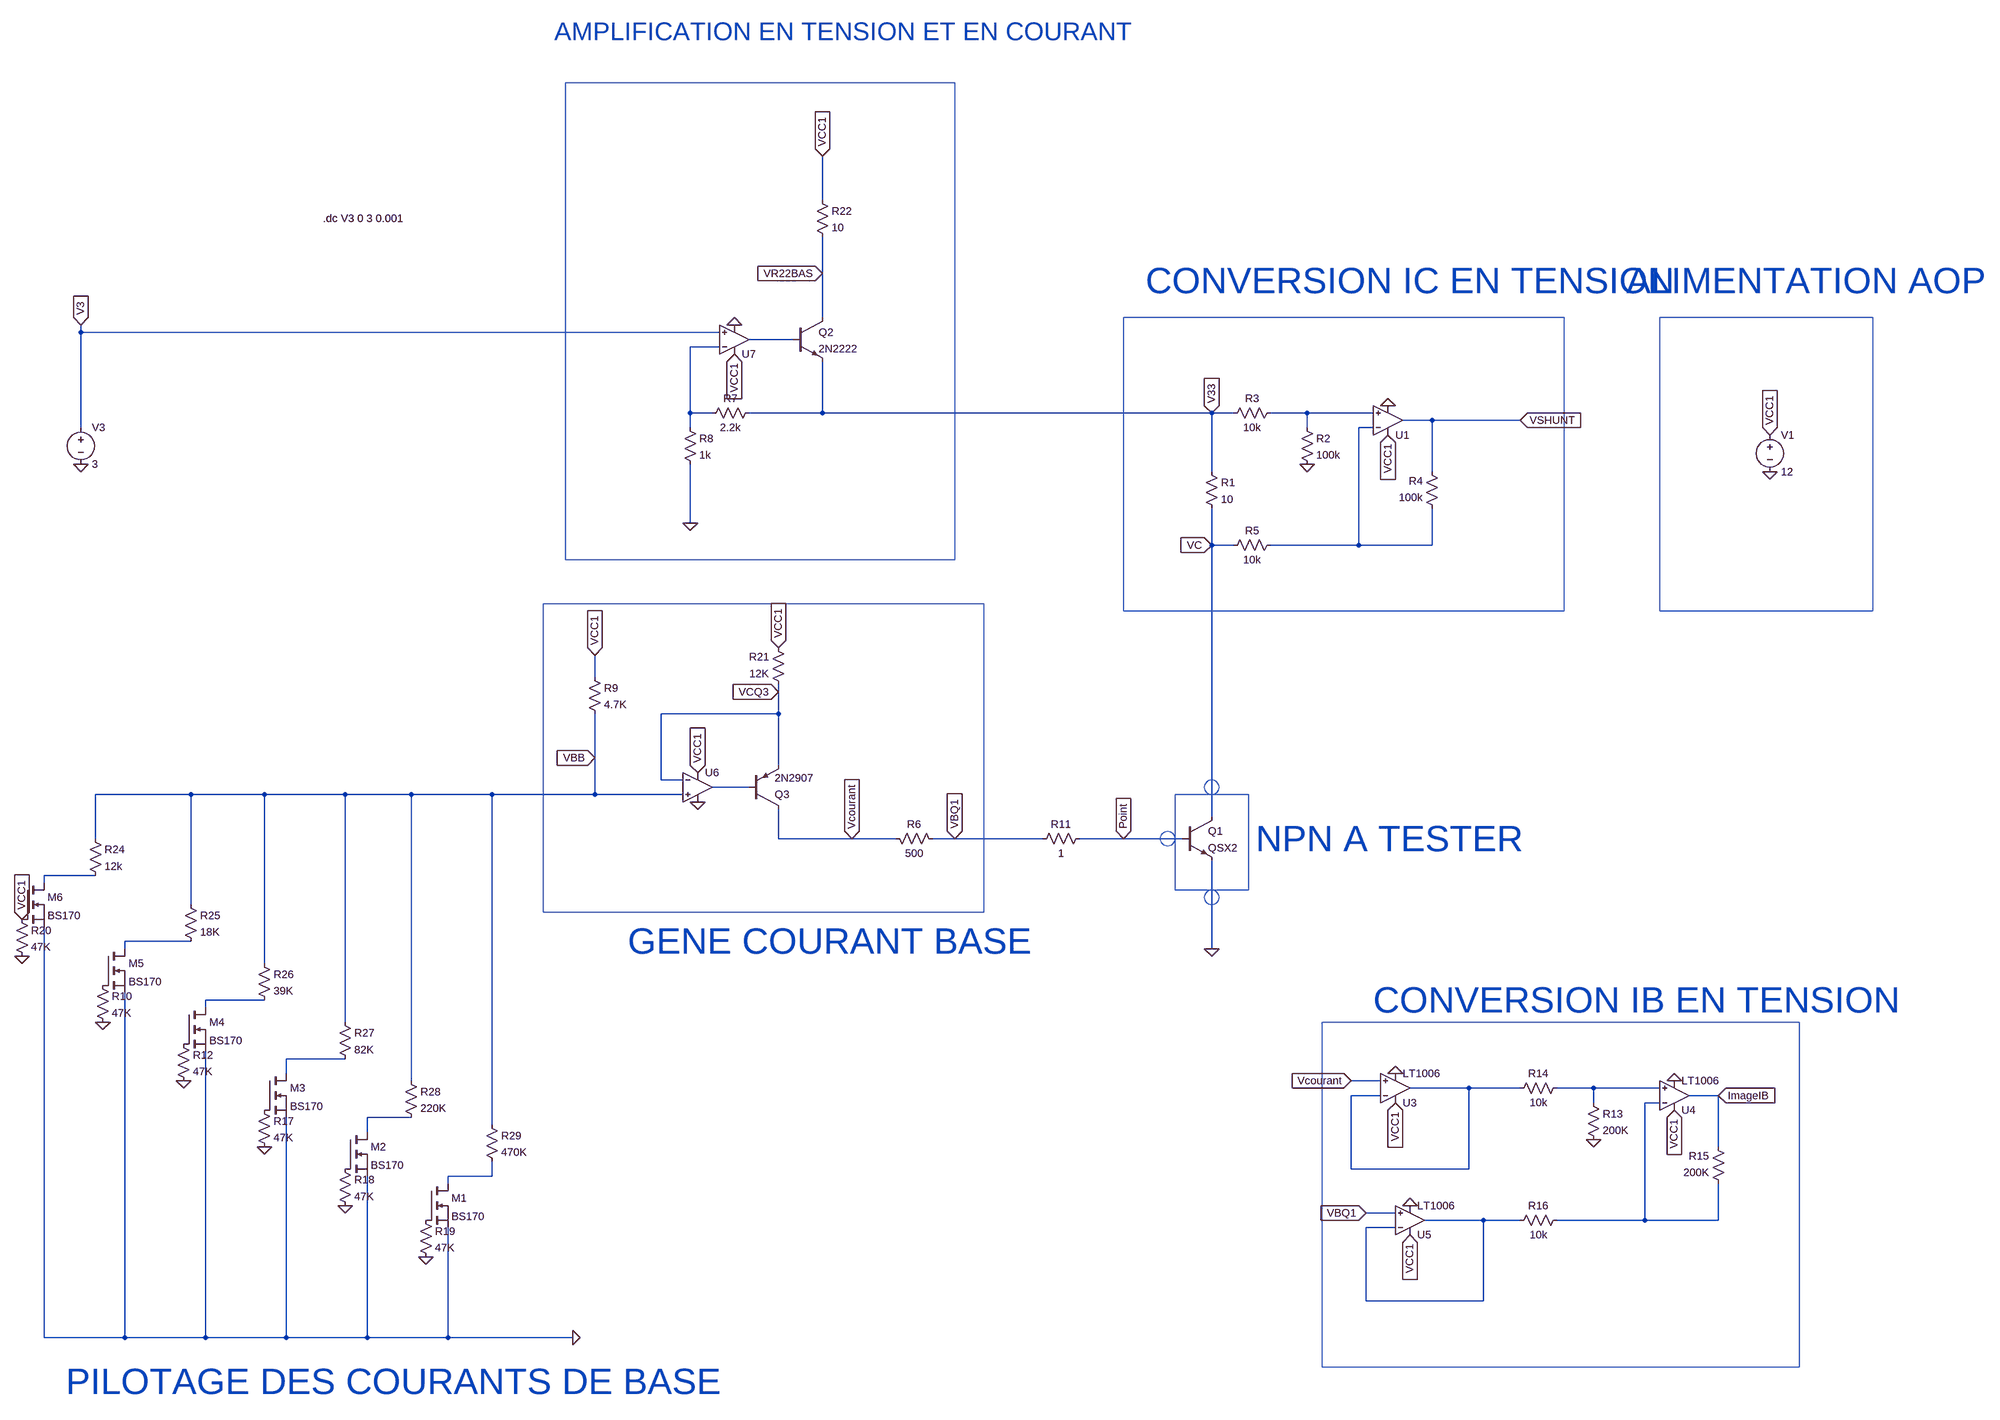
[diagram p0: schematic DFTA272LTSPICE.asc]
DFTA272LTSPICE.asc, the LTspice schematic file:
Version 4
SHEET 1 2916 2164
WIRE -816 -688 -816 -784
WIRE -816 -528 -816 -608
WIRE -816 -432 -816 -528
WIRE -2432 -400 -2432 -416
WIRE -1040 -400 -2432 -400
WIRE -880 -384 -976 -384
WIRE -1040 -368 -1104 -368
WIRE -1104 -224 -1104 -368
WIRE -1056 -224 -1104 -224
WIRE -816 -224 -816 -336
WIRE -816 -224 -976 -224
WIRE 32 -224 -816 -224
WIRE 80 -224 32 -224
WIRE 240 -224 160 -224
WIRE 384 -224 240 -224
WIRE 512 -208 448 -208
WIRE 704 -208 512 -208
WIRE -2432 -192 -2432 -400
WIRE -1104 -192 -1104 -224
WIRE 240 -192 240 -224
WIRE 384 -192 352 -192
WIRE 32 -96 32 -224
WIRE 512 -96 512 -208
WIRE -1104 16 -1104 -112
WIRE 32 64 32 -16
WIRE 80 64 32 64
WIRE 352 64 352 -192
WIRE 352 64 160 64
WIRE 512 64 512 -16
WIRE 512 64 352 64
WIRE -1312 352 -1312 304
WIRE -912 384 -912 368
WIRE -912 432 -912 384
WIRE -912 432 -1168 432
WIRE -1312 528 -1312 432
WIRE -912 544 -912 432
WIRE -1168 576 -1168 432
WIRE -1120 576 -1168 576
WIRE -976 592 -1056 592
WIRE -2192 608 -2400 608
WIRE -2032 608 -2192 608
WIRE -1856 608 -2032 608
WIRE -1712 608 -1856 608
WIRE -1536 608 -1712 608
WIRE -1312 608 -1312 528
WIRE -1312 608 -1536 608
WIRE -1120 608 -1312 608
WIRE 32 656 32 64
WIRE -2400 704 -2400 608
WIRE -912 704 -912 640
WIRE -752 704 -912 704
WIRE -656 704 -752 704
WIRE -528 704 -576 704
WIRE -336 704 -528 704
WIRE -160 704 -256 704
WIRE -32 704 -160 704
WIRE -2400 784 -2512 784
WIRE -2512 800 -2512 784
WIRE -2192 848 -2192 608
WIRE -2192 928 -2336 928
WIRE -2336 944 -2336 928
WIRE 32 944 32 752
WIRE -2032 976 -2032 608
WIRE -2032 1056 -2160 1056
WIRE -2160 1072 -2160 1056
WIRE -1856 1104 -1856 608
WIRE -1856 1184 -1984 1184
WIRE -1984 1216 -1984 1184
WIRE -1712 1232 -1712 608
WIRE 400 1232 336 1232
WIRE 592 1248 464 1248
WIRE 704 1248 592 1248
WIRE 864 1248 784 1248
WIRE 1008 1248 864 1248
WIRE 400 1264 336 1264
WIRE 1136 1264 1072 1264
WIRE 864 1280 864 1248
WIRE 1008 1280 976 1280
WIRE -1712 1312 -1808 1312
WIRE -1536 1328 -1536 608
WIRE -1808 1344 -1808 1312
WIRE 1136 1376 1136 1264
WIRE 336 1424 336 1264
WIRE 592 1424 592 1248
WIRE 592 1424 336 1424
WIRE -1536 1440 -1536 1408
WIRE -1536 1440 -1632 1440
WIRE -1632 1456 -1632 1440
WIRE 432 1520 368 1520
WIRE 624 1536 496 1536
WIRE 704 1536 624 1536
WIRE 976 1536 976 1280
WIRE 976 1536 784 1536
WIRE 1136 1536 1136 1456
WIRE 1136 1536 976 1536
WIRE 432 1552 368 1552
WIRE 368 1712 368 1552
WIRE 624 1712 624 1536
WIRE 624 1712 368 1712
WIRE -2512 1792 -2512 896
WIRE -2336 1792 -2336 1040
WIRE -2336 1792 -2512 1792
WIRE -2160 1792 -2160 1168
WIRE -2160 1792 -2336 1792
WIRE -1984 1792 -1984 1312
WIRE -1984 1792 -2160 1792
WIRE -1808 1792 -1808 1440
WIRE -1808 1792 -1984 1792
WIRE -1632 1792 -1632 1552
WIRE -1632 1792 -1808 1792
WIRE -1360 1792 -1632 1792
FLAG 240 -112 0
FLAG 1248 -176 VCC1
IOPIN 1248 -176 In
FLAG 416 -176 VCC1
IOPIN 416 -176 In
FLAG 1248 -96 0
FLAG 416 -240 0
FLAG 704 -208 VSHUNT
IOPIN 704 -208 In
FLAG 32 944 0
FLAG -2432 -112 0
FLAG 32 64 VC
IOPIN 32 64 In
FLAG 32 -224 V33
IOPIN 32 -224 In
FLAG -1008 -352 VCC1
IOPIN -1008 -352 In
FLAG -1008 -416 0
FLAG -1104 16 0
FLAG -2432 -416 V3
IOPIN -2432 -416 In
FLAG -1088 560 VCC1
IOPIN -1088 560 In
FLAG -752 704 Vcourant
IOPIN -752 704 In
FLAG -528 704 VBQ1
IOPIN -528 704 In
FLAG 864 1360 0
FLAG 1040 1296 VCC1
IOPIN 1040 1296 In
FLAG 1040 1232 0
FLAG 1136 1264 ImageIB
IOPIN 1136 1264 In
FLAG 336 1232 Vcourant
IOPIN 336 1232 In
FLAG 368 1520 VBQ1
IOPIN 368 1520 In
FLAG 464 1504 0
FLAG 464 1568 VCC1
IOPIN 464 1568 In
FLAG -1312 304 VCC1
IOPIN -1312 304 In
FLAG -816 -784 VCC1
IOPIN -816 -784 In
FLAG -912 288 VCC1
IOPIN -912 288 In
FLAG -160 704 Point
IOPIN -160 704 In
FLAG -816 -528 VR22BAS
IOPIN -816 -528 In
FLAG -912 384 VCQ3
IOPIN -912 384 In
FLAG -1360 1792 0
FLAG -1312 528 VBB
IOPIN -1312 528 In
FLAG -1088 624 0
FLAG -2560 880 VCC1
IOPIN -2560 880 In
FLAG -1680 1616 0
FLAG -1856 1504 0
FLAG -2032 1376 0
FLAG -2208 1232 0
FLAG -2384 1104 0
FLAG -2560 960 0
FLAG 432 1216 0
FLAG 432 1280 VCC1
IOPIN 432 1280 In
SYMBOL npn -32 656 R0
SYMATTR InstName Q1
SYMATTR Value QSX2
SYMBOL res 16 -112 R0
SYMATTR InstName R1
SYMATTR Value 10
SYMBOL res 224 -208 R0
SYMATTR InstName R2
SYMATTR Value 100k
SYMBOL res 176 -240 R90
WINDOW 0 0 56 VBottom 2
WINDOW 3 32 56 VTop 2
SYMATTR InstName R3
SYMATTR Value 10k
SYMBOL res 528 0 R180
WINDOW 0 36 76 Left 2
WINDOW 3 36 40 Left 2
SYMATTR InstName R4
SYMATTR Value 100k
SYMBOL res 176 48 R90
WINDOW 0 0 56 VBottom 2
WINDOW 3 32 56 VTop 2
SYMATTR InstName R5
SYMATTR Value 10k
SYMBOL voltage 1248 -192 R0
WINDOW 123 0 0 Left 0
WINDOW 39 0 0 Left 0
SYMATTR InstName V1
SYMATTR Value 12
SYMBOL voltage -2432 -208 R0
WINDOW 123 0 0 Left 0
WINDOW 39 0 0 Left 0
SYMATTR InstName V3
SYMATTR Value 3
SYMBOL res -960 -240 R90
WINDOW 0 0 56 VBottom 2
WINDOW 3 32 56 VTop 2
SYMATTR InstName R7
SYMATTR Value 2.2k
SYMBOL res -1120 -208 R0
SYMATTR InstName R8
SYMATTR Value 1k
SYMBOL res -672 688 M90
WINDOW 0 0 56 VBottom 2
WINDOW 3 32 56 VTop 2
SYMATTR InstName R6
SYMATTR Value 500
SYMBOL res -240 688 R90
WINDOW 0 0 56 VBottom 2
WINDOW 3 32 56 VTop 2
SYMATTR InstName R11
SYMATTR Value 1
SYMBOL OpAmps\\LT1006 1040 1328 M180
SYMATTR InstName U4
SYMBOL res 848 1264 R0
SYMATTR InstName R13
SYMATTR Value 200K
SYMBOL res 800 1232 R90
WINDOW 0 0 56 VBottom 2
WINDOW 3 32 56 VTop 2
SYMATTR InstName R14
SYMATTR Value 10k
SYMBOL res 1152 1472 R180
WINDOW 0 36 76 Left 2
WINDOW 3 36 40 Left 2
SYMATTR InstName R15
SYMATTR Value 200K
SYMBOL res 800 1520 R90
WINDOW 0 0 56 VBottom 2
WINDOW 3 32 56 VTop 2
SYMATTR InstName R16
SYMATTR Value 10k
SYMBOL OpAmps\\LT1006 464 1600 M180
SYMATTR InstName U5
SYMBOL res -1328 336 R0
SYMATTR InstName R9
SYMATTR Value 4.7K
SYMBOL npn -880 -432 R0
SYMATTR InstName Q2
SYMATTR Value 2N2222
SYMBOL res -832 -704 R0
SYMATTR InstName R22
SYMATTR Value 10
SYMBOL res -896 384 R180
WINDOW 0 36 76 Left 2
WINDOW 3 36 40 Left 2
SYMATTR InstName R21
SYMATTR Value 12K
SYMBOL pnp -976 640 M180
SYMATTR InstName Q3
SYMATTR Value 2N2907
SYMBOL res -2416 688 R0
SYMATTR InstName R24
SYMATTR Value 12k
SYMBOL res -2208 832 R0
SYMATTR InstName R25
SYMATTR Value 18K
SYMBOL res -2048 960 R0
SYMATTR InstName R26
SYMATTR Value 39K
SYMBOL res -1872 1088 R0
SYMATTR InstName R27
SYMATTR Value 82K
SYMBOL res -1728 1216 R0
SYMATTR InstName R28
SYMATTR Value 220K
SYMBOL res -1552 1312 R0
SYMATTR InstName R29
SYMATTR Value 470K
SYMBOL nmos -1680 1456 R0
SYMATTR InstName M1
SYMATTR Value BS170
SYMBOL nmos -1856 1344 R0
SYMATTR InstName M2
SYMATTR Value BS170
SYMBOL nmos -2032 1216 R0
SYMATTR InstName M3
SYMATTR Value BS170
SYMBOL nmos -2208 1072 R0
SYMATTR InstName M4
SYMATTR Value BS170
SYMBOL nmos -2384 944 R0
SYMATTR InstName M5
SYMATTR Value BS170
SYMBOL nmos -2560 800 R0
SYMATTR InstName M6
SYMATTR Value BS170
SYMBOL OpAmps\\UniversalOpAmp2 -1088 592 R0
SYMATTR InstName U6
SYMBOL res -2400 1008 R0
SYMATTR InstName R10
SYMATTR Value 47K
SYMBOL res -2224 1136 R0
SYMATTR InstName R12
SYMATTR Value 47K
SYMBOL res -2048 1280 R0
SYMATTR InstName R17
SYMATTR Value 47K
SYMBOL res -1872 1408 R0
SYMATTR InstName R18
SYMATTR Value 47K
SYMBOL res -1696 1520 R0
SYMATTR InstName R19
SYMATTR Value 47K
SYMBOL res -2576 864 R0
SYMATTR InstName R20
SYMATTR Value 47K
SYMBOL OpAmps\\LT1006 432 1312 M180
SYMATTR InstName U3
SYMBOL OpAmps\\UniversalOpAmp2 -1008 -384 M180
SYMATTR InstName U7
SYMBOL OpAmps\\UniversalOpAmp2 416 -208 M180
SYMATTR InstName U1
TEXT -1904 -648 Left 2 !.dc V3 0 3 0.001
TEXT 384 1056 Left 6 ;CONVERSION IB EN TENSION
TEXT 128 704 Left 6 ;NPN A TESTER
TEXT -1400 -1056 Left 5 ;AMPLIFICATION EN TENSION ET EN COURANT
TEXT -112 -512 Left 6 ;CONVERSION IC EN TENSION
TEXT -2464 1888 Left 6 ;PILOTAGE DES COURANTS DE BASE
TEXT 936 -512 Left 6 ;ALIMENTATION AOP
TEXT -1240 928 Left 6 ;GENE COURANT BASE
RECTANGLE Normal 1312 1856 272 1104
RECTANGLE Normal 112 816 -48 608
RECTANGLE Normal -528 96 -1376 -944
RECTANGLE Normal 800 208 -160 -432
RECTANGLE Normal 1472 208 1008 -432
RECTANGLE Normal -464 864 -1424 192
CIRCLE Normal 48 608 16 576
CIRCLE Normal 48 848 16 816
CIRCLE Normal -48 720 -80 688

The netlist it stands for:
* DFTA272LTSPICE.asc
Q1 VC Point 0 0 QSX2
R1 V33 VC 10
R2 N003 0 100k
R3 N003 V33 10k
R4 N004 VSHUNT 100k
R5 N004 VC 10k
V1 VCC1 0 12
V3 V3 0 3
R7 V33 N002 2.2k
R8 N002 0 1k
R6 Vcourant VBQ1 500
R11 Point VBQ1 1
XU4 N011 N012 VCC1 0 ImageIB LT1006  ; pins In+ In- V+ V- OUT
R13 N011 0 200K
R14 N011 N010 10k
R15 N012 ImageIB 200K
R16 N012 N015 10k
XU5 VBQ1 N015 VCC1 0 N015 LT1006  ; pins In+ In- V+ V- OUT
R9 VCC1 VBB 4.7K
Q2 VR22BAS N001 V33 0 2N2222
R22 VCC1 VR22BAS 10
R21 VCQ3 VCC1 12K
Q3 Vcourant N005 VCQ3 0 2N2907
R24 VBB N006 12k
R25 VBB N007 18K
R26 VBB N008 39K
R27 VBB N009 82K
R28 VBB N013 220K
R29 VBB N014 470K
M1 N014 P001 0 0 BS170
M2 N013 P002 0 0 BS170
M3 N009 P003 0 0 BS170
M4 N008 P004 0 0 BS170
M5 N007 P005 0 0 BS170
M6 N006 VCC1 0 0 BS170
XU6 VBB VCQ3 VCC1 0 N005 level2 Avol=1Meg GBW=10Meg Slew=10Meg Ilimit=25m Rail=0 Vos=0 En=0 Enk=0 In=0 Ink=0 Rin=500Meg  ; pins In+ In- V+ V- OUT
R10 P005 0 47K
R12 P004 0 47K
R17 P003 0 47K
R18 P002 0 47K
R19 P001 0 47K
R20 VCC1 0 47K
XU3 Vcourant N010 VCC1 0 N010 LT1006  ; pins In+ In- V+ V- OUT
XU7 V3 N002 VCC1 0 N001 level2 Avol=1Meg GBW=10Meg Slew=10Meg Ilimit=25m Rail=0 Vos=0 En=0 Enk=0 In=0 Ink=0 Rin=500Meg  ; pins In+ In- V+ V- OUT
XU1 N003 N004 VCC1 0 VSHUNT level2 Avol=1Meg GBW=10Meg Slew=10Meg Ilimit=25m Rail=0 Vos=0 En=0 Enk=0 In=0 Ink=0 Rin=500Meg  ; pins In+ In- V+ V- OUT
.model NPN NPN
.model PNP PNP
.lib standard.bjt
.model NMOS NMOS
.model PMOS PMOS
.lib standard.mos
.dc V3 0 3 0.001
* CONVERSION IB EN TENSION
* NPN A TESTER
* AMPLIFICATION EN TENSION ET EN COURANT
* CONVERSION IC EN TENSION
* PILOTAGE DES COURANTS DE BASE
* ALIMENTATION AOP
* GENE COURANT BASE
.lib LTC.lib
.lib UniversalOpAmp2.lib
.backanno
.end